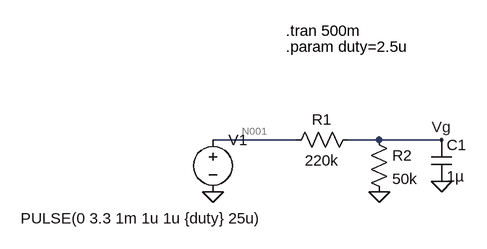
[diagram p0: schematic PWM_RC_filter.asc]
PWM_RC_filter.asc, the LTspice schematic file:
Version 4
SHEET 1 880 680
WIRE 144 176 16 176
WIRE 272 176 224 176
WIRE 368 176 272 176
FLAG 16 256 0
FLAG 272 256 0
FLAG 368 240 0
FLAG 368 176 Vg
SYMBOL voltage 16 160 R0
WINDOW 3 -296 137 Left 2
WINDOW 123 0 0 Left 0
WINDOW 39 0 0 Left 0
SYMATTR Value PULSE(0 3.3 1m 1u 1u {duty} 25u)
SYMATTR InstName V1
SYMBOL res 240 160 R90
WINDOW 0 0 56 VBottom 2
WINDOW 3 32 56 VTop 2
SYMATTR InstName R1
SYMATTR Value 220k
SYMBOL res 256 160 R0
SYMATTR InstName R2
SYMATTR Value 50k
SYMBOL cap 352 176 R0
SYMATTR InstName C1
SYMATTR Value 1µ
TEXT 128 8 Left 2 !.tran 500m
TEXT 128 32 Left 2 !.param duty=2.5u

The netlist it stands for:
* PWM_RC_filter.asc
V1 N001 0 PULSE(0 3.3 1m 1u 1u {duty} 25u)
R1 Vg N001 220k
R2 Vg 0 50k
C1 Vg 0 1µ
.tran 500m
.param duty=2.5u
.backanno
.end

* Results of the author's LTspice run, read from the files saved beside the schematic
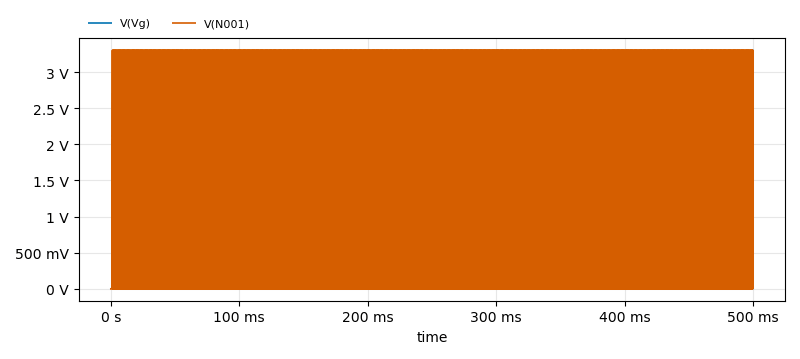
[diagram p1: Transient Analysis of PWM_RC_filter.asc, plotted from the saved traces]
* Transient Analysis, 1 run:
*   V(Vg): min 0 V, max 85.67 mV, average 78.5 mV, rms 80.15 mV, last 85.63 mV
*   V(N001): min 0 V, max 3.3 V, average 461.1 mV, rms 1.234 V, last 0 V